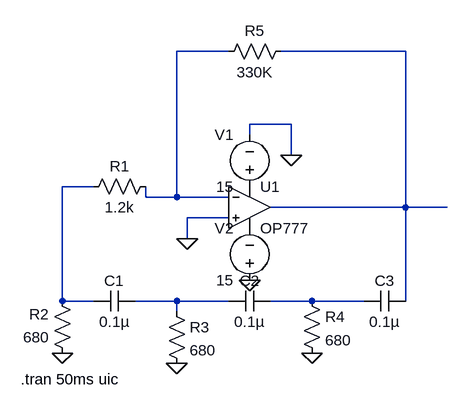
[diagram p0: schematic 4 RC phase shift  oscillator using op-amp.asc]
4 RC phase shift  oscillator using op-amp.asc, the LTspice schematic file:
Version 4
SHEET 1 880 680
WIRE 160 -64 80 -64
WIRE 432 -64 240 -64
WIRE 256 48 192 48
WIRE 192 64 192 48
WIRE 256 96 256 48
WIRE -48 144 -96 144
WIRE 32 160 32 144
WIRE 80 160 80 -64
WIRE 80 160 32 160
WIRE 160 160 80 160
WIRE 432 176 432 -64
WIRE 432 176 224 176
WIRE 496 176 432 176
WIRE 160 192 96 192
WIRE 96 224 96 192
WIRE -96 320 -96 144
WIRE -48 320 -96 320
WIRE 80 320 16 320
WIRE 160 320 80 320
WIRE 288 320 224 320
WIRE 368 320 288 320
WIRE 432 320 432 176
WIRE 80 336 80 320
FLAG 256 96 0
FLAG 192 288 0
FLAG 96 224 0
FLAG -96 400 0
FLAG 80 416 0
FLAG 288 400 0
SYMBOL OpAmps\\OP777 192 112 R0
SYMATTR InstName U1
SYMBOL voltage 192 160 R180
WINDOW 0 24 96 Left 2
WINDOW 3 24 16 Left 2
WINDOW 123 0 0 Left 0
WINDOW 39 0 0 Left 0
SYMATTR InstName V1
SYMATTR Value 15
SYMBOL voltage 192 304 R180
WINDOW 0 24 96 Left 2
WINDOW 3 24 16 Left 2
WINDOW 123 0 0 Left 0
WINDOW 39 0 0 Left 0
SYMATTR InstName V2
SYMATTR Value 15
SYMBOL res 48 128 R90
WINDOW 0 0 56 VBottom 2
WINDOW 3 32 56 VTop 2
SYMATTR InstName R1
SYMATTR Value 1.2k
SYMBOL res -80 416 R180
WINDOW 0 36 76 Left 2
WINDOW 3 36 40 Left 2
SYMATTR InstName R2
SYMATTR Value 680
SYMBOL cap 16 304 R90
WINDOW 0 0 32 VBottom 2
WINDOW 3 32 32 VTop 2
SYMATTR InstName C1
SYMATTR Value 0.1µ
SYMBOL res 64 320 R0
SYMATTR InstName R3
SYMATTR Value 680
SYMBOL res 256 -80 R90
WINDOW 0 0 56 VBottom 2
WINDOW 3 32 56 VTop 2
SYMATTR InstName R5
SYMATTR Value 330K
SYMBOL res 272 304 R0
SYMATTR InstName R4
SYMATTR Value 680
SYMBOL cap 224 304 R90
WINDOW 0 0 32 VBottom 2
WINDOW 3 32 32 VTop 2
SYMATTR InstName C2
SYMATTR Value 0.1µ
SYMBOL cap 432 304 R90
WINDOW 0 0 32 VBottom 2
WINDOW 3 32 32 VTop 2
SYMATTR InstName C3
SYMATTR Value 0.1µ
TEXT -160 440 Left 2 !.tran 50ms uic

The netlist it stands for:
* 4 RC phase shift  oscillator using op-amp.asc
XU1 0 N001 P001 P002 N002 OP777  ; pins In+ In- V+ V- OUT
V1 P001 0 15
V2 0 P002 15
R1 N001 N003 1.2k
R2 0 N003 680
C1 N004 N003 0.1µ
R3 N004 0 680
R5 N002 N001 330K
R4 N005 0 680
C2 N005 N004 0.1µ
C3 N002 N005 0.1µ
.tran 50ms uic
.lib ADI.lib
.backanno
.end